# Altium schematic sheet in3ator.SchDoc: Main
size A3; Date: 17/09/18; Author: Pablo Sánchez Bergasa; Revision: 2.A.1; SheetNumber: 1; SheetTotal: 9; DocumentName: Main
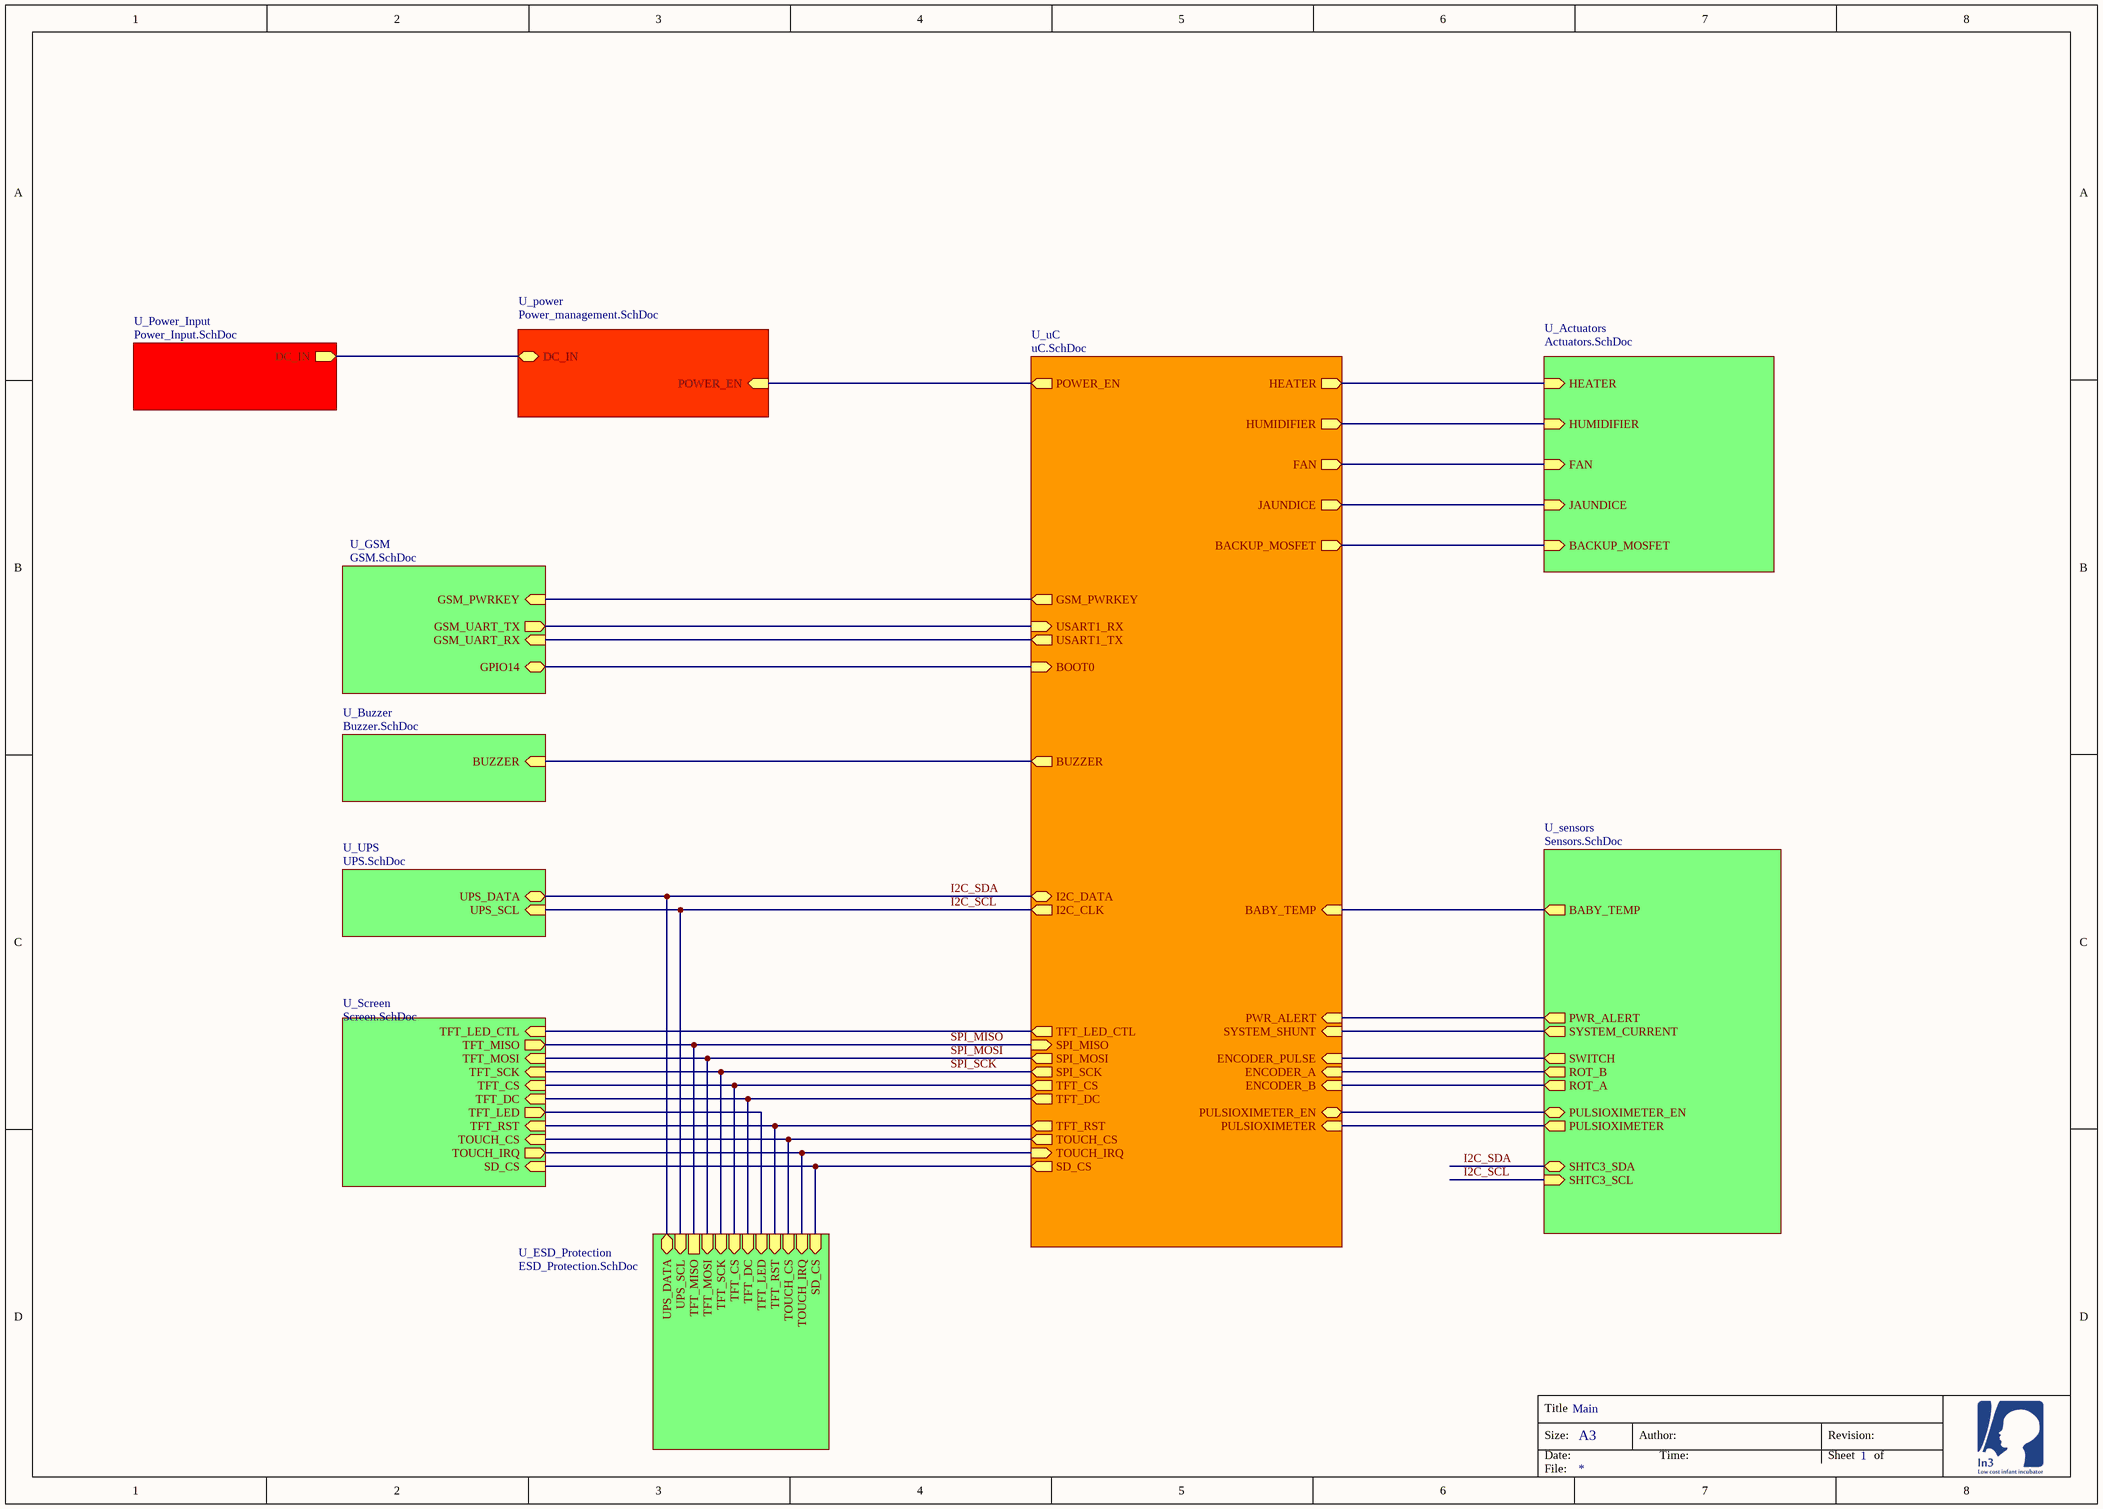
[diagram p0: in3ator.SchDoc]

## Sub-sheets
U_Actuators = Actuators.SchDoc: HEATER (in), HUMIDIFIER (in), JAUNDICE (in), FAN (in), BACKUP_MOSFET (in)
U_Buzzer = Buzzer.SchDoc: BUZZER (in)
U_ESD_Protection = ESD_Protection.SchDoc: SD_CS (in), TFT_CS (in), TOUCH_CS (in), TOUCH_IRQ (in), TFT_RST (in), TFT_DC (in), TFT_MOSI (in), TFT_SCK (in), TFT_LED (in), TFT_MISO, UPS_SCL (in), UPS_DATA
U_GSM = GSM.SchDoc: GSM_UART_TX (out), GSM_UART_RX (in), GSM_PWRKEY (in), GPIO14
U_power = Power_management.SchDoc: POWER_EN (in), DC_IN
U_Power_Input = Power_Input.SchDoc: DC_IN
U_Screen = Screen.SchDoc: SD_CS (in), TFT_CS (in), TOUCH_CS (in), TOUCH_IRQ (out), TFT_RST (in), TFT_DC (in), TFT_MOSI (in), TFT_MISO, TFT_LED_CTL (in), TFT_SCK (in), TFT_LED (out)
U_sensors = Sensors.SchDoc: SYSTEM_CURRENT (out), SWITCH (out), ROT_B (out), ROT_A (out), PULSIOXIMETER_EN, SHTC3_SCL (in), SHTC3_SDA (bidir), PWR_ALERT (out), PULSIOXIMETER (out), BABY_TEMP (out)
U_uC = uC.SchDoc: SYSTEM_SHUNT (in), HEATER (out), BUZZER (out), JAUNDICE (out), HUMIDIFIER (out), POWER_EN (out), BOOT0 (in), FAN (out), I2C_DATA (bidir), I2C_CLK (out), SPI_MISO, SPI_SCK (out), SPI_MOSI (out), TOUCH_IRQ (in), TFT_DC (out), TFT_CS (out), TFT_RST (out), TOUCH_CS (out), SD_CS (out), TFT_LED_CTL (out), GSM_PWRKEY (out), USART1_RX (in), USART1_TX (out), ENCODER_PULSE (in), ENCODER_A (in), ENCODER_B (in), PULSIOXIMETER (in), PWR_ALERT (in), PULSIOXIMETER_EN, BACKUP_MOSFET (out), BABY_TEMP (in)
U_UPS = UPS.SchDoc: UPS_DATA (bidir), UPS_SCL (in)

## Nets
I2C_SCL: sheet U_sensors/SHTC3_SCL, sheet U_uC/I2C_CLK, sheet U_UPS/UPS_SCL, sheet U_ESD_Protection/UPS_SCL
I2C_SDA: sheet U_sensors/SHTC3_SDA, sheet U_uC/I2C_DATA, sheet U_UPS/UPS_DATA, sheet U_ESD_Protection/UPS_DATA
SPI_MISO: sheet U_uC/SPI_MISO, sheet U_Screen/TFT_MISO, sheet U_ESD_Protection/TFT_MISO
SPI_MOSI: sheet U_uC/SPI_MOSI, sheet U_Screen/TFT_MOSI, sheet U_ESD_Protection/TFT_MOSI
SPI_SCK: sheet U_uC/SPI_SCK, sheet U_Screen/TFT_SCK, sheet U_ESD_Protection/TFT_SCK
(unnamed): sheet U_power/POWER_EN, sheet U_uC/POWER_EN
(unnamed): sheet U_power/DC_IN, sheet U_Power_Input/DC_IN
(unnamed): sheet U_GSM/GSM_UART_TX, sheet U_uC/USART1_RX
(unnamed): sheet U_GSM/GSM_UART_RX, sheet U_uC/USART1_TX
(unnamed): sheet U_GSM/GSM_PWRKEY, sheet U_uC/GSM_PWRKEY
(unnamed): sheet U_GSM/GPIO14, sheet U_uC/BOOT0
(unnamed): sheet U_sensors/SYSTEM_CURRENT, sheet U_uC/SYSTEM_SHUNT
(unnamed): sheet U_sensors/SWITCH, sheet U_uC/ENCODER_PULSE
(unnamed): sheet U_sensors/ROT_B, sheet U_uC/ENCODER_A
(unnamed): sheet U_sensors/ROT_A, sheet U_uC/ENCODER_B
(unnamed): sheet U_sensors/PULSIOXIMETER_EN, sheet U_uC/PULSIOXIMETER_EN
(unnamed): sheet U_sensors/PWR_ALERT, sheet U_uC/PWR_ALERT
(unnamed): sheet U_sensors/PULSIOXIMETER, sheet U_uC/PULSIOXIMETER
(unnamed): sheet U_sensors/BABY_TEMP, sheet U_uC/BABY_TEMP
(unnamed): sheet U_uC/HEATER, sheet U_Actuators/HEATER
(unnamed): sheet U_uC/BUZZER, sheet U_Buzzer/BUZZER
(unnamed): sheet U_uC/JAUNDICE, sheet U_Actuators/JAUNDICE
(unnamed): sheet U_uC/HUMIDIFIER, sheet U_Actuators/HUMIDIFIER
(unnamed): sheet U_uC/FAN, sheet U_Actuators/FAN
(unnamed): sheet U_uC/TOUCH_IRQ, sheet U_Screen/TOUCH_IRQ, sheet U_ESD_Protection/TOUCH_IRQ
(unnamed): sheet U_uC/TFT_DC, sheet U_Screen/TFT_DC, sheet U_ESD_Protection/TFT_DC
(unnamed): sheet U_uC/TFT_CS, sheet U_Screen/TFT_CS, sheet U_ESD_Protection/TFT_CS
(unnamed): sheet U_uC/TFT_RST, sheet U_Screen/TFT_RST, sheet U_ESD_Protection/TFT_RST
(unnamed): sheet U_uC/TOUCH_CS, sheet U_Screen/TOUCH_CS, sheet U_ESD_Protection/TOUCH_CS
(unnamed): sheet U_uC/SD_CS, sheet U_Screen/SD_CS, sheet U_ESD_Protection/SD_CS
(unnamed): sheet U_uC/TFT_LED_CTL, sheet U_Screen/TFT_LED_CTL
(unnamed): sheet U_uC/BACKUP_MOSFET, sheet U_Actuators/BACKUP_MOSFET
(unnamed): sheet U_Screen/TFT_LED, sheet U_ESD_Protection/TFT_LED

## Notes on the sheet
- Title
- Size:
- Date:
- A3
- Author:
- Time:
- Revision:
- Sheet
- of
- File: